# Altium schematic sheet main.SchDoc: Pulser Laser Board
size A4; Date: 04.08.2023; DocumentNumber: 1; SheetNumber: 1; SheetTotal: 2; FileInfo: main.SchDoc
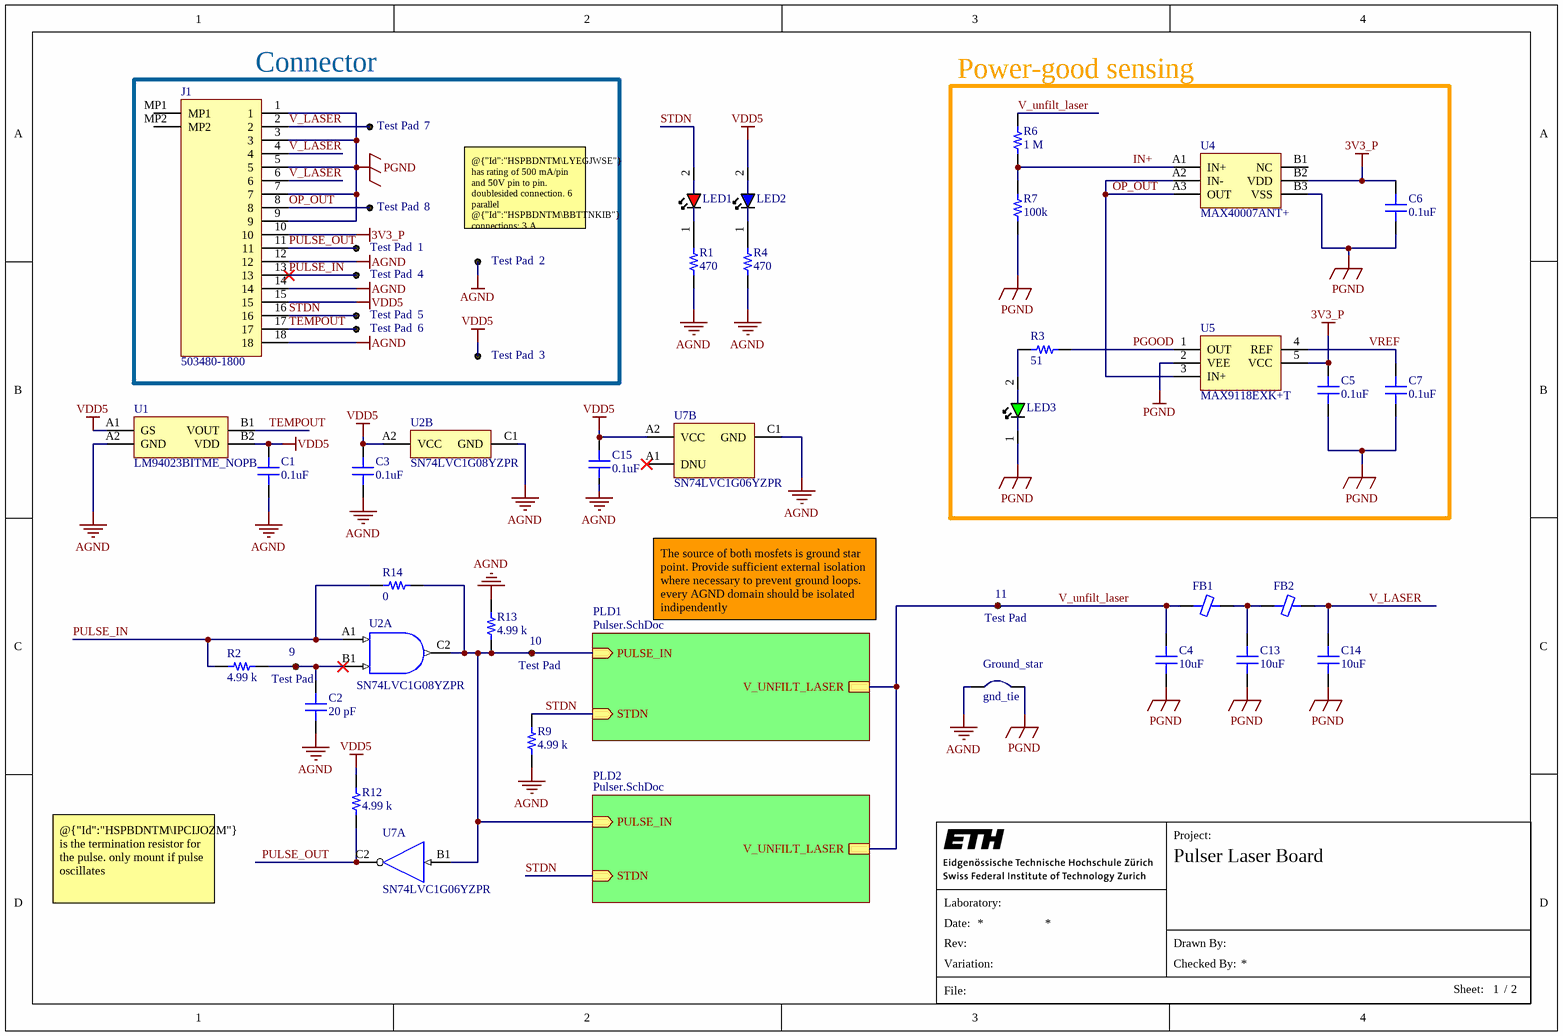
[diagram p0: main.SchDoc]

## Parts
1  Test Pad  [Pad-0.6mm]  (no BOM)
2  Test Pad  [Pad-0.6mm]  (no BOM)
3  Test Pad  [Pad-0.6mm]  (no BOM)
4  Test Pad  [Pad-0.6mm]  (no BOM)
5  Test Pad  [Pad-0.6mm]  (no BOM)
6  Test Pad  [Pad-0.6mm]  (no BOM)
7  Test Pad  [Pad-0.6mm]  (no BOM)
8  Test Pad  [Pad-0.6mm]  (no BOM)
9  Test Pad  [Pad-0.6mm]  (no BOM)
10  Test Pad  [Pad-0.6mm]  (no BOM)
11  Test Pad  [Pad-0.6mm]  (no BOM)
C1  0.1uF  [CAP 0201_0603]
C2  20 pF  [CAP 0402_1005]
C3  0.1uF  [CAP 0201_0603]
C4  10uF  [CAP 0603_1608]
C5  0.1uF  [CAP 0201_0603]
C6  0.1uF  [CAP 0201_0603]
C7  0.1uF  [CAP 0201_0603]
C13  10uF  [CAP 0603_1608]
C14  10uF  [CAP 0603_1608]
C15  0.1uF  [CAP 0201_0603]
FB1  (no value)  [FER 0603_1608]
FB2  (no value)  [FER 0603_1608]
Ground_star  gnd_tie  [GND_TIE]  (net tie, no BOM)
J1  503480-1800  [5034801800]
LED1  APG0603SEC-E-TT  [APG0603SECETT]  (value not drawn)
LED2  APG0603VBC-A1-5MAV  [APG0603SECETT]  (value not drawn)
LED3  APG0603ZGC-5MAV  [APG0603SECETT]  (value not drawn)
R1  470  [RES 0201_0603]
R2  4.99 k  [RES 0402_1005]
R3  51  [RES 0201_0603]
R4  470  [RES 0201_0603]
R6  1 M  [RES 0201_0603]
R7  100k  [RES 0201_0603]
R9  4.99 k  [RES 0201_0603]
R12  4.99 k  [RES 0402_1005]
R13  4.99 k  [RES 0201_0603]
R14  0  [RES 0201_0603]
U1  LM94023BITME_NOPB  [BGA4C40P2X2_81X81X68]
U2  SN74LVC1G08YZPR  [YZP0005ADAD]  (parts A,B of 2)
U4  MAX40007ANT+  [BGA6C40P3X2_124X84X69]
U5  MAX9118EXK+T  [SOT65P210X110-5N]
U7  SN74LVC1G06YZPR  [YZP0005ADAD]  (parts A,B of 2)

## Blocks framed on the sheet
Connector: 1-8 J1
Power-good sensing: C5-C7 LED3 R3 R6 R7 U4 U5

## Sub-sheets
PLD1 = Pulser.SchDoc: PULSE_IN (in), V_UNFILT_LASER, STDN (in)
PLD2 = Pulser.SchDoc: PULSE_IN (in), V_UNFILT_LASER, STDN (in)

## Nets
3V3_P: C5.2 C6.2 J1.10 U4.B2(VDD) U5.5(VCC)
AGND: 2.1 C1.1 C2.1 C3.1 C15.1 Ground_star.1 J1.12 J1.14 J1.18 R1.1 R4.1 R9.1 R13.1 U1.A2(GND) U2.C1(GND) U7.C1(GND)
PGND: C4.1 C5.1 C6.1 C7.1 C13.1 C14.1 Ground_star.2 J1.1 J1.3 J1.5 J1.7 J1.9 LED3.1(K) R7.1 U4.B3(VSS) U5.2(VEE)
VDD5: 3.1 C1.2 C3.2 C15.2 J1.15 LED2.2(A) R12.2 U1.A1(GS) U1.B2(VDD) U2.A2(VCC) U7.A2(VCC)
IN+: R6.1 R7.2 U4.A1(IN+)
OP_OUT: 8.1 J1.8 U4.A2(IN-) U4.A3(OUT) U5.3(IN+)
PGOOD: R3.2 U5.1(OUT)
PULSE_IN: 4.1 J1.13 R2.1 R14.1 U2.A1(A)
PULSE_OUT: 1.1 J1.11 R12.1 U7.C2(Y)
STDN: 5.1 J1.16 LED1.2(A) R9.2 ; sheet PLD1/STDN, sheet PLD2/STDN
TEMPOUT: 6.1 J1.17 U1.B1(VOUT)
V_LASER: 7.1 C14.2 FB2.2 J1.2 J1.4 J1.6
V_unfilt_laser: 11.1 C4.2 FB1.1 R6.2 ; sheet PLD1/V_UNFILT_LASER, sheet PLD2/V_UNFILT_LASER
VREF: C7.2 U5.4(REF)
Net9_1: 9.1 C2.2 R2.2 U2.B1(B)
Net10_1: 10.1 R13.2 R14.2 U2.C2(Y) U7.B1(A) ; sheet PLD1/PULSE_IN, sheet PLD2/PULSE_IN
NetC13_2: C13.2 FB1.2 FB2.1
NetLED1_1: LED1.1(K) R1.2
NetLED2_1: LED2.1(K) R4.2
NetLED3_2: LED3.2(A) R3.1

Not connected (* = marked no-connect by the designer): J1 MP1 MP2; U4 B1(NC); U7 A1(DNU)*

## Notes on the sheet
- (near 2) @{"Id":"HSPBDNTM\LYEGJWSE"}  has rating of 500 mA/pin and 50V pin to pin. doublesided connection. 6 parallel @{"Id":"HSPBDNTM\BBTTNKIB"} connections: 3 A
- The source of both mosfets is ground star point. Provide sufficient external isolation where necessary to prevent ground loops. every AGND domain should be isolated indipendently
- @{"Id":"HSPBDNTM\IPCIJOZM"} is the termination resistor for the pulse. only mount if pulse oscillates
- Project:
- Laboratory:
- Date:
- File:
- Rev:
- Variation:
- Drawn By:
- Checked By:
- Sheet:
- /

## Library data of the parts
1-11 = Test Pad: 0.6mm SMT Test Pad; Mounting Technology: SMT
C1 C3 C5-C7 C15 = GRM033R6YA104ME14D: CAP CER 0.1UF 35V X5R 0201; manufacturer: Murata Electronics; Capacitance: 0.1 µF; Tolerance: ±20%; Part Number: GRM033R6YA104ME14D; Applications: General Purpose; componentlink1description: Datasheet; componentlink1url: https://search.murata.co.jp/Ceramy/image/img/A01X/G101/ENG/GRM033R6YA104ME14-01.pdf; componentlink2description: DigiKey Link; componentlink2url: https://www.digikey.com/en/products/detail/murata-electronics/GRM033R6YA104ME14D/5027516; Device Package: 0201 (0603 Metric); lastupdated: 15/07/2023 19:00:56; Lifecycle Status: Active; Minimum Order: 1; Mounting Type: Surface Mount; Operating Temperature: -55°C ~ 85°C; Package / Case: 0201 (0603 Metric); packaging: CutTape; partid: 17; Part Status: Active; price: 0.01; series: GRM; Size / Dimension: 0.024" L x 0.012" W (0.60mm x 0.30mm); Supplier 1: Digi-Key; Supplier Part Number 1: 490-10431-1-ND; Temperature Coefficient: X5R; Thickness (Max): 0.013" (0.33mm); Voltage - Rated: 35V; Value: 0.1uF; Supplier 2: Mouser; Supplier Part Number 2: 81-GRM33R6YA104ME14D
C2 = GCM1555C1H200FA16D: CAP CER 20PF 50V C0G/NP0 0402; manufacturer: Murata Electronics; Temperature Coefficient: C0G, NP0; Tolerance: ±1%; Part Number: GCM1555C1H200FA16D; Applications: Automotive; Capacitance: 20 pF; componentlink1description: Datasheet; componentlink1url: https://search.murata.co.jp/Ceramy/image/img/A01X/G101/ENG/GCM1555C1H200FA16-01.pdf; componentlink2description: DigiKey Link; componentlink2url: https://www.digikey.com/en/products/detail/murata-electronics/GCM1555C1H200FA16D/13401847; Device Package: 0402 (1005 Metric); lastupdated: 15/07/2023 19:03:20; Lifecycle Status: Active; Minimum Order: 1; Mounting Type: Surface Mount, MLCC; Operating Temperature: -55°C ~ 125°C; Package / Case: 0402 (1005 Metric); packaging: TapeAndReel; partid: 45712; Part Status: Active; price: 0.01; Ratings: AEC-Q200; series: GCM; Size / Dimension: 0.039" L x 0.020" W (1.00mm x 0.50mm); Supplier 1: Digi-Key; Supplier Part Number 1: 490-GCM1555C1H200FA16DCT-ND; Thickness (Max): 0.022" (0.55mm); Voltage - Rated: 50V; Value: 20 pF; Supplier 2: Mouser; Supplier Part Number 2: 81-GCM1555C1H200FA6D
C4 C13 C14 = ZRB18AR61E106ME01L: CAP CER 10UF 25V X5R 0603; Manufacturer: Murata; Dielectric Material: Ceramic; Multilayer: Yes; Tolerance  (fill in as +-): 20%; Supplier 1: Mouser; Manufacturer Part Number: ZRB18AR61E106ME01L; RoHS: Yes; Category: Ceramic Capacitors; Stock 1: 348476; Pricing 1: 1=0.36, 10=0.18, 50=0.18, 100=0.128, 1000=0.122, 10000=0.097 (USD); Mounting Technology: Surface Mount; Pins: 2; Package Shape: Rectangular; Case/Package: 0603; Min Operating Temperature: -55°C; Max Operating Temperature: 85°C; Capacitor Type: Ceramic; Packaging: Tape and Reel; Tolerance (fill in as +-): 20%; Rated DC Voltage (URdc): 25V; Temperature Characteristics Code: X5R; Termination: Wraparound; Reach SVHC Compliant: Yes; RoHS Compliant: Yes; ComponentLink1URL: https://datasheet.ciiva.com:443/pdfs/VipMasterIC/IC/MURE/MURE-S-A0004380799/MURE-S-A0004414239-1.pdf?src-supplier=IHS+Markit; ComponentLink1Description: https://datasheet.ciiva.com:443/pdfs/VipMasterIC/IC/MURE/MURE-S-A0004380799/MURE-S-A0004414239-1.pdf?src-supplier=IHS+Markit; ComponentLink2URL: http://www.farnell.com/datasheets/2243360.pdf?src-supplier=Farnell; ComponentLink2Description: http://www.farnell.com/datasheets/2243360.pdf?src-supplier=Farnell; ComponentLink3URL: http://www.farnell.com/datasheets/2243360.pdf?src-supplier=Newark; ComponentLink3Description: http://www.farnell.com/datasheets/2243360.pdf?src-supplier=Newark; ComponentLink4URL: https://datasheet.octopart.com/ZRB18AR61E106ME01L-Murata-datasheet-67356777.pdf?src-supplier=Element14; ComponentLink4Description: https://datasheet.octopart.com/ZRB18AR61E106ME01L-Murata-datasheet-67356777.pdf?src-supplier=Element14; ComponentLink5URL: https://search.murata.co.jp/Ceramy/image/img/A01X/G101/ENG/ZRB18AR61E106ME01-01.pdf?src-supplier=Digi-Key; ComponentLink5Description: https://search.murata.co.jp/Ceramy/image/img/A01X/G101/ENG/ZRB18AR61E106ME01-01.pdf?src-supplier=Digi-Key; ComponentLink6URL: http://www.farnell.com/datasheets/1885591.pdf?src-supplier=Newark; ComponentLink6Description: http://www.farnell.com/datasheets/1885591.pdf?src-supplier=Newark; ComponentLink7URL: http://www.farnell.com/datasheets/2243360.pdf?src-supplier=Element14; ComponentLink7Description: http://www.farnell.com/datasheets/2243360.pdf?src-supplier=Element14; ComponentLink8URL: https://datasheet.octopart.com/ZRB18AR61E106ME01L-Murata-datasheet-166166243.pdf?src-supplier=TME; ComponentLink8Description: https://datasheet.octopart.com/ZRB18AR61E106ME01L-Murata-datasheet-166166243.pdf?src-supplier=TME; Supplier Part Number 1: 81-ZRB18AR61E106ME1L; Value: 10uF
FB1 FB2 = BLM18SP101SN1: FERRITE BEAD 100 OHM 0603 1LN; Manufacturer: Murata; Manufacturer Part Number: BLM18SP101SN1D; RoHS: Yes; Category: Ferrite Beads and Chips; Pricing 1: 1=0.21, 10=0.108, 50=0.108, 100=0.074, 1000=0.055, 10000=0.048 (USD); Stock 1: 17354; Supplier 1: Mouser; Supplier Part Number 1: 81-BLM18SP101SN1D
J1 = 503480-1800: Conn FPC  18 POS 0.5mm; Manufacturer: Molex; Supplier 1: Mouser; Manufacturer Part Number: 5034801800; RoHS: Yes; Category: FFC / FPC; Stock 1: 17529; Pricing 1: 1=1.48, 10=1.23, 50=1.23, 100=1.06, 1000=0.885, 10000=0.766 (USD); ComponentLink1URL: https://datasheet.ciiva.com/671/5034800400-sd-671136.pdf?src-supplier=Digi-Key; ComponentLink1Description: https://datasheet.ciiva.com/671/5034800400-sd-671136.pdf?src-supplier=Digi-Key; ComponentLink2URL: https://datasheet.ciiva.com/10366/5034801800-ffc-fpc-connectors-10366583.pdf?src-supplier=Avnet; ComponentLink2Description: https://datasheet.ciiva.com/10366/5034801800-ffc-fpc-connectors-10366583.pdf?src-supplier=Avnet; ComponentLink3URL: https://datasheet.ciiva.com/5137/5034801800-ffc-fpc-connectors-179548-5137672.pdf?src-supplier=Mouser; ComponentLink3Description: https://datasheet.ciiva.com/5137/5034801800-ffc-fpc-connectors-179548-5137672.pdf?src-supplier=Mouser; Supplier Part Number 1: 538-503480-1800
LED1 = APG0603SEC-E-TT: Diode LED RED 10 mA @ 1.93 V lv=40; Manufacturer: Kingbright; Optoelectronic Device Type: SINGLE COLOR LED; Supplier 1: Mouser; Manufacturer Part Number: APG0603SEC-E-TT; RoHS: Yes; Category: LEDs; Stock 1: 6830; Pricing 1: 1=0.49, 10=0.299, 50=0.299, 100=0.172, 1000=0.123, 10000=0.106 (USD); Reach SVHC Compliant: Yes; RoHS Compliant: Yes; ComponentLink1URL: https://datasheet.ciiva.com:443/pdfs/VipMasterIC/IC/KBEC/KBEC-S-A0008424280/KBEC-S-A0008424280-1.pdf?src-supplier=IHS+Markit; ComponentLink1Description: https://datasheet.ciiva.com:443/pdfs/VipMasterIC/IC/KBEC/KBEC-S-A0008424280/KBEC-S-A0008424280-1.pdf?src-supplier=IHS+Markit; ComponentLink2URL: http://www.kingbrightusa.com/images/catalog/SPEC/APG0603SEC-E-TT.pdf?src-supplier=Digi-Key; ComponentLink2Description: http://www.kingbrightusa.com/images/catalog/SPEC/APG0603SEC-E-TT.pdf?src-supplier=Digi-Key; Supplier Part Number 1: 604-APG0603SECETT
LED2 = APG0603VBC-A1-5MAV: Diode LED BLUE 10 mA @ 2.9 V lv=60; Manufacturer: Kingbright; Supplier 1: Mouser; Manufacturer Part Number: APG0603VBC-A1-5MAV; RoHS: Yes; Category: LEDs; Stock 1: 23353; Pricing 1: 1=0.64, 10=0.396, 50=0.396, 100=0.228, 1000=0.171, 10000=0.146 (USD); Supplier Part Number 1: 604-APG0603VBCA15MAV
LED3 = APG0603ZGC-5MAV: Diode LED GREEN 5 mA @ 2.85 V lv=80(?); Manufacturer: Kingbright; Supplier 1: Mouser; Manufacturer Part Number: APG0603ZGC-5MAV; RoHS: Yes; Category: LEDs; Stock 1: 11940; Pricing 1: 1=0.54, 10=0.335, 50=0.335, 100=0.193, 1000=0.139, 10000=0.118 (USD); Supplier Part Number 1: 604-APG0603ZGC-5MAV
R1 R4 = ERJ-1GNF4991C_1: RES SMD 470 OHM 1% 1/20W 0201; Manufacturer: Panasonic; Manufacturer Part Number: ERJ-1GNF4700C; Power: 50mW; Rated Temperature: 70°C; Temperature Coefficient: 200ppm/°C; Working Voltage: 25V; Package Height: 0.23mm; Package Length: 0.6mm; Package Width: 0.3mm; Reference Standard: AEC-Q200; Supplier: Mouser; Supplier Part Number: 667-ERJ-1GNF4700C; RoHS: Yes; Category: Chip SMD Resistors; Stock: 294822; Pricing: 1=0.1, 10=0.03, 50=0.03, 100=0.014, 1000=0.01, 10000=0.007 (USD); Mounting Technology: Surface Mount; Pins: 2; Package Shape: Rectangular; Case/Package: 0201; Terminal Finish: Nickel; Min Operating Temperature: -55°C; Max Operating Temperature: 125°C; Tolerance: 1%; JESD-609 Code: e3; Resistor Type: FIXED RESISTOR; Construction: Rectangular; Package Style: SMTMeter; Packaging: Tape and Reel; Value: 470; Technology: METAL GLAZE/THICK FILM; Termination: Wraparound; Reach SVHC Compliant: Yes; RoHS Compliant: Yes; ComponentLink1URL: https://datasheet.ciiva.com:443/pdfs/VipMasterIC/IC/PANA/PANA-S-A0009889626/PANA-S-A0009889626-1.pdf?src-supplier=IHS+Markit; ComponentLink1Description: https://datasheet.ciiva.com:443/pdfs/VipMasterIC/IC/PANA/PANA-S-A0009889626/PANA-S-A0009889626-1.pdf?src-supplier=IHS+Markit; ComponentLink2URL: https://datasheet.ciiva.com/24027/aoa0000ce2-24027045.pdf?src-supplier=Mouser; ComponentLink2Description: https://datasheet.ciiva.com/24027/aoa0000ce2-24027045.pdf?src-supplier=Mouser; ComponentLink3URL: https://datasheet.ciiva.com/43467/1678782-43467046.pdf?src-supplier=Farnell; ComponentLink3Description: https://datasheet.ciiva.com/43467/1678782-43467046.pdf?src-supplier=Farnell; ComponentLink4URL: https://datasheet.ciiva.com/46375/1678782-46375269.pdf?src-supplier=Element14; ComponentLink4Description: https://datasheet.ciiva.com/46375/1678782-46375269.pdf?src-supplier=Element14; ComponentLink5URL: https://datasheet.ciiva.com/7830/1678782-7830713.pdf?src-supplier=Element14; ComponentLink5Description: https://datasheet.ciiva.com/7830/1678782-7830713.pdf?src-supplier=Element14; Supplier 1: Mouser; Supplier Part Number 1: 667-ERJ-1GNF4700C
R2 R12 = ERA-2AEB4991X: RES SMD 4.99KOHM 0.1% 1/16W 0402; Manufacturer: Panasonic Electronic Components; Power (Watts): 0.063W, 1/16W; Resistance: 4.99 kOhms; Temperature Coefficient: ±25ppm/°C; Part Number: ERA-2AEB4991X; ComponentLink1Description: Datasheet; ComponentLink1URL: https://industrial.panasonic.com/cdbs/www-data/pdf/RDM0000/AOA0000C307.pdf; ComponentLink2Description: DigiKey Link; ComponentLink2URL: https://www.digikey.com/en/products/detail/panasonic-electronic-components/ERA-2AEB4991X/2026116; Composition: Thin Film; Device Package: 0402 (1005 Metric); Features: Automotive AEC-Q200; Height - Seated (Max): 0.016" (0.40mm); LastUpdated: 13/07/2023 19:22:52; Lifecycle Status: Active; Minimum Order: 1; Number of Terminations: 2; Operating Temperature: -55°C ~ 155°C; Package / Case: 0402 (1005 Metric); Packaging: TapeAndReel; PartId: 6112; Part Status: Active; Price: 0.04; Ratings: AEC-Q200; Series: ERA-2A; Size / Dimension: 0.039" L x 0.020" W (1.00mm x 0.50mm); Supplier 1: Digi-Key; Supplier Part Number 1: 10-ERA-2AEB4991XCT-ND; Supplier Device Package: 0402; Tolerance: ±0.1%; Value: 4.99 k; Supplier 2: Mouser; Supplier Part Number 2: 667-ERA-2AEB4991X
R3 = ERJ-1GNF51R0C: RES SMD 51 OHM 1% 1/20W 0201; Manufacturer: Panasonic; Manufacturer Part Number: ERJ1GNF51R0C; Power: 50mW; Rated Temperature: 70°C; Temperature Coefficient: 200ppm/°C; Working Voltage: 25V; Package Height: 0.23mm; Package Length: 0.6mm; Package Width: 0.3mm; Reference Standard: AEC-Q200; Supplier: Mouser; Supplier Part Number: 667-ERJ-1GNF51R0C; RoHS: Yes; Category: Chip SMD Resistors; Stock: 39473; Pricing: 1=0.1, 10=0.033, 50=0.033, 100=0.015, 1000=0.011, 10000=0.007 (USD); Mounting Technology: Surface Mount; Pins: 2; Package Shape: Rectangular; Case/Package: 0201; Terminal Finish: Nickel; Min Operating Temperature: -55°C; Max Operating Temperature: 125°C; Tolerance: 1%; JESD-609 Code: e3; Resistor Type: FIXED RESISTOR; Construction: Rectangular; Package Style: SMTMeter; Packaging: Tape and Reel; Value: 51; Technology: METAL GLAZE/THICK FILM; Termination: Wraparound; Reach SVHC Compliant: Yes; RoHS Compliant: Yes; ComponentLink1URL: https://datasheet.ciiva.com:443/pdfs/VipMasterIC/IC/PANA/PANA-S-A0009889626/PANA-S-A0009889626-1.pdf?src-supplier=IHS+Markit; ComponentLink1Description: https://datasheet.ciiva.com:443/pdfs/VipMasterIC/IC/PANA/PANA-S-A0009889626/PANA-S-A0009889626-1.pdf?src-supplier=IHS+Markit; ComponentLink2URL: https://datasheet.ciiva.com/43467/1678782-43467023.pdf?src-supplier=Farnell; ComponentLink2Description: https://datasheet.ciiva.com/43467/1678782-43467023.pdf?src-supplier=Farnell; ComponentLink3URL: https://datasheet.ciiva.com/24130/aoa0000ce2-24130655.pdf?src-supplier=Mouser; ComponentLink3Description: https://datasheet.ciiva.com/24130/aoa0000ce2-24130655.pdf?src-supplier=Mouser; ComponentLink4URL: https://datasheet.ciiva.com/46375/1678782-46375932.pdf?src-supplier=Element14; ComponentLink4Description: https://datasheet.ciiva.com/46375/1678782-46375932.pdf?src-supplier=Element14; ComponentLink5URL: https://datasheet.ciiva.com/7891/aoa0000ce2-7891288.pdf?src-supplier=Element14; ComponentLink5Description: https://datasheet.ciiva.com/7891/aoa0000ce2-7891288.pdf?src-supplier=Element14; Supplier 1: Mouser; Supplier Part Number 1: 667-ERJ-1GNF51R0C
R6 = ERJ-U01F1004C: RES SMD 1MOHM 1% 1/20W 0201; Manufacturer: Panasonic; Supplier: Mouser; Supplier Part Number: 667-ERJ-U01F1004C; Manufacturer Part Number: ERJ-U01F1004C; RoHS: Yes; Category: Chip SMD Resistors; Stock: 28729; Pricing: 1=0.35, 10=0.157, 50=0.157, 100=0.071, 1000=0.049, 10000=0.038 (USD); ComponentLink1URL: https://datasheet.ciiva.com/24200/ras-erj-u-267552-24200389.pdf?src-supplier=Mouser; ComponentLink1Description: https://datasheet.ciiva.com/24200/ras-erj-u-267552-24200389.pdf?src-supplier=Mouser; Supplier 1: Mouser; Supplier Part Number 1: 667-ERJ-U01F1004C
R7 = ERJ-1RHD1003C: RES SMD 100 kOHM 0.5% 1/20W 0201; Manufacturer: Panasonic; Additional Feature: PRECISION; Power: 50mW; Rated Temperature: 70°C; Temperature Coefficient: 50ppm/°C; Working Voltage: 15V; Package Height: 0.23mm; Package Length: 0.6mm; Package Width: 0.3mm; Supplier 1: Mouser; Manufacturer Part Number: ERJ-1RHD1003C; RoHS: Yes; Category: Chip SMD Resistors; Stock 1: 3926; Pricing 1: 1=0.14, 10=0.049, 50=0.049, 100=0.03, 1000=0.021, 10000=0.016 (USD); Mounting Technology: Surface Mount; Pins: 2; Package Shape: Rectangular; Case/Package: 0201; Terminal Finish: Nickel; Min Operating Temperature: -55°C; Max Operating Temperature: 125°C; Tolerance: 0.5%; JESD-609 Code: e3; Resistor Type: FIXED RESISTOR; Construction: Rectangular; Package Style: SMTMeter; Packaging: Tape and Reel; Value: 100k; Technology: METAL GLAZE/THICK FILM; Termination: Wraparound; Reach SVHC Compliant: Yes; RoHS Compliant: Yes; ComponentLink1URL: https://datasheet.ciiva.com:443/pdfs/VipMasterIC/IC/PANA/PANA-S-A0009889626/PANA-S-A0009889626-1.pdf?src-supplier=IHS+Markit; ComponentLink1Description: https://datasheet.ciiva.com:443/pdfs/VipMasterIC/IC/PANA/PANA-S-A0009889626/PANA-S-A0009889626-1.pdf?src-supplier=IHS+Markit; ComponentLink2URL: http://www.mouser.com/ds/2/315/AOA0000C283-1093288.pdf?src-supplier=Mouser; ComponentLink2Description: http://www.mouser.com/ds/2/315/AOA0000C283-1093288.pdf?src-supplier=Mouser; ComponentLink3URL: https://industrial.panasonic.com/cdbs/www-data/pdf/RDA0000/AOA0000C304.pdf?src-supplier=Digi-Key; ComponentLink3Description: https://industrial.panasonic.com/cdbs/www-data/pdf/RDA0000/AOA0000C304.pdf?src-supplier=Digi-Key; ComponentLink4URL: https://industrial.panasonic.com/cdbs/www-data/pdf/RDM0000/DMM0000COL11.pdf?src-supplier=Digi-Key; ComponentLink4Description: https://industrial.panasonic.com/cdbs/www-data/pdf/RDM0000/DMM0000COL11.pdf?src-supplier=Digi-Key; ComponentLink5URL: http://www.onlinecomponents.com/datasheet/erj-1rhd1003c.aspx?p=44466300&src-supplier=Onlinecomponents.com; ComponentLink5Description: http://www.onlinecomponents.com/datasheet/erj-1rhd1003c.aspx?p=44466300&src-supplier=Onlinecomponents.com; ComponentLink6URL: https://datasheet.octopart.com/ERJ-1RHD1003C-Panasonic-datasheet-48891056.pdf?src-supplier=Future+Electronics; ComponentLink6Description: https://datasheet.octopart.com/ERJ-1RHD1003C-Panasonic-datasheet-48891056.pdf?src-supplier=Future+Electronics; ComponentLink7URL: https://datasheet.octopart.com/ERJ-1RHD1003C-Panasonic-datasheet-13266541.pdf?src-supplier=Electro+Sonic; ComponentLink7Description: https://datasheet.octopart.com/ERJ-1RHD1003C-Panasonic-datasheet-13266541.pdf?src-supplier=Electro+Sonic; ComponentLink8URL: https://datasheet.octopart.com/ERJ-1RHD1003C-Panasonic-datasheet-154766169.pdf?src-supplier=Master+Electronics; ComponentLink8Description: https://datasheet.octopart.com/ERJ-1RHD1003C-Panasonic-datasheet-154766169.pdf?src-supplier=Master+Electronics; Supplier Part Number 1: 667-ERJ-1RHD1003C
R9 R13 = ERJ-1GNF4991C: RES SMD 4.99 kOHM 1% 1/20W 0201; Manufacturer: Panasonic; Supplier: Mouser; Supplier Part Number: 667-ERJ-1GNF4991C; Manufacturer Part Number: ERJ-1GNF4991C; RoHS: Yes; Category: Chip SMD Resistors; Stock: 73903; Pricing: 1=0.1, 10=0.033, 50=0.033, 100=0.015, 1000=0.011, 10000=0.007 (USD); ComponentLink1URL: https://datasheet.ciiva.com/24210/aoa0000ce2-24210761.pdf?src-supplier=Mouser; ComponentLink1Description: https://datasheet.ciiva.com/24210/aoa0000ce2-24210761.pdf?src-supplier=Mouser; Supplier 1: Mouser; Supplier Part Number 1: 667-ERJ-1GNF4991C; Value: 4.99 k
R14 = ERJ-1GN0R00C: RES SMD 0OHM 0.1% 1/20W 0201; Manufacturer: Panasonic; Power: 50mW; Rated Temperature: 70°C; Package Height: 0.23mm; Package Length: 0.6mm; Package Width: 0.3mm; Reference Standard: AEC-Q200; Supplier: Mouser; Supplier Part Number: 667-ERJ-1GN0R00C; Manufacturer Part Number: ERJ-1GN0R00C; RoHS: Yes; Category: Chip SMD Resistors; Stock: 4285208; Pricing: 1=0.1, 10=0.018, 50=0.018, 100=0.008, 1000=0.006, 10000=0.004 (USD); Mounting Technology: Surface Mount; Pins: 2; Package Shape: Rectangular; Case/Package: 0201; Terminal Finish: Nickel; Min Operating Temperature: -55°C; Max Operating Temperature: 125°C; JESD-609 Code: e3; Resistor Type: FIXED RESISTOR; Construction: Rectangular; Package Style: SMTMeter; Packaging: Tape and Reel; Value: 0; Technology: METAL GLAZE/THICK FILM; Termination: Wraparound; Reach SVHC Compliant: Yes; RoHS Compliant: Yes; ComponentLink1URL: https://datasheet.ciiva.com:443/pdfs/VipMasterIC/IC/PANA/PANA-S-A0009459603/PANA-S-A0009459603-1.pdf?src-supplier=IHS+Markit; ComponentLink1Description: https://datasheet.ciiva.com:443/pdfs/VipMasterIC/IC/PANA/PANA-S-A0009459603/PANA-S-A0009459603-1.pdf?src-supplier=IHS+Markit; Supplier 1: Mouser; Supplier Part Number 1: 667-ERJ-1GN0R00C
U1 = LM94023BITME_NOPB: IC temperature sensor; Manufacturer_Name: Texas Instruments; Manufacturer_Part_Number: LM94023BITME/NOPB; Datasheet Link: http://www.ti.com/lit/gpn/lm94023; Height: 0.675mm; Mouser Part Number: 926-94023BITME/NOPB; Mouser Price/Stock: https://www.mouser.co.uk/ProductDetail/Texas-Instruments/LM94023BITME-NOPB?qs=QbsRYf82W3GaNge%252BVoa5rg%3D%3D; Arrow Part Number: LM94023BITME/NOPB; Arrow Price/Stock: https://www.arrow.com/en/products/lm94023bitmenopb/texas-instruments; Supplier 1: Mouser; Supplier Part Number 1: 926-94023bitME/NOPB
U2 = SN74LVC1G08YZPR: IC Single 2-Input Positive-AND Gate, YZP0005ADAD, LARGE T&R; Manufacturer: Texas Instruments; Voltage(Nom)(V): 1.8,2.5,3.3,5; VCC(Min)(V): 1.65; Bits(#): 1; VCC(Max)(V): 5.5; ICC @ Nom Voltage(Max)(mA): 0.01; Input Type: CMOS/TTL; Output Type: CMOS; 3-State Output: No; Output Drive (IOL/IOH)(Max)(mA): 32/-32; Logic: True; Gate Type: AND; F @ Nom Voltage(Max)(Mhz): 150; tpd @ Nom Voltage(Max)(ns): 4.5,6,4,5; Technology Family: LVC; Rating: Catalog; Sub-Family: AND Gate; Operating Temperature Range(C): -40 to 125,-40 to 85; PackageReference: YZP0005ADAD; Schmitt Trigger: No; Generic Part Number: SN74LVC1G08; DatasheetVersion: SCES217Y; Manufacturer Part Number: SN74LVC1G08YZPR; Supplier 1: Mouser; Supplier Part Number 1: 595-SN74LVC1G08YZPR
U4 = MAX40007ANT+: Operational Amplifier; Manufacturer: Maxim; Manufacturer Part Number: MAX40007ANT+T; Amplifier Type: OPERATIONAL AMPLIFIER; Category: Amplifiers - Op Amps, Buffer, Instrumentation; ComponentLink1Description: https://datasheet.ciiva.com:443/pdfs/VipMasterIC/IC/MAXM/MAXM-S-A0004197655/MAXM-S-A0004197655-1.pdf?src-supplier=IHS+Markit; ComponentLink1URL: https://datasheet.ciiva.com:443/pdfs/VipMasterIC/IC/MAXM/MAXM-S-A0004197655/MAXM-S-A0004197655-1.pdf?src-supplier=IHS+Markit; ComponentLink2Description: https://datasheets.maximintegrated.com/en/ds/MAX40007.pdf?src-supplier=Digi-Key; ComponentLink2URL: https://datasheets.maximintegrated.com/en/ds/MAX40007.pdf?src-supplier=Digi-Key; Pricing 1: 1=2.12, 10=1.86, 50=1.86, 100=1.53, 1000=1.04, 10000=0.932 (USD); Reach SVHC Compliant: Yes; RoHS: Yes; RoHS Compliant: Yes; Stock 1: 4078; Supplier 1: Mouser; Supplier Part Number 1: 700-MAX40007ANT+T
U5 = MAX9118EXK+T: IC comparator; Manufacturer: Maxim; Average Bias Current-Max (IIB): 2nA; Bias Current-Max (IIB) @25C: 1nA; Channels: 1; Input Offset Voltage-Max: 10mV; Max Supply Current: 1.3uA; Nominal Supply Voltage: 5V; Output Type: OPEN-DRAIN; Package Body Material: Plastic; Package Equivalence Code: TSSOP5/6,.08; Power Supplies: 2.5V; Qualification Status: Not Qualified; Supply Voltage Limit-Max: 6V; Amplifier Type: COMPARATOR; Case/Package: TSSOP; Category: Comparators; ComponentLink1Description: https://datasheet.ciiva.com:443/pdfs/VipMasterIC/IC/MAXM/MAXMS06218/MAXMS06218-1.pdf?src-supplier=IHS+Markit; ComponentLink1URL: https://datasheet.ciiva.com:443/pdfs/VipMasterIC/IC/MAXM/MAXMS06218/MAXMS06218-1.pdf?src-supplier=IHS+Markit; ComponentLink2Description: https://datasheet.ciiva.com/1828/max9117-max9120-1828265.pdf?src-supplier=Digi-Key; ComponentLink2URL: https://datasheet.ciiva.com/1828/max9117-max9120-1828265.pdf?src-supplier=Digi-Key; ComponentLink3Description: https://datasheet.ciiva.com/1828/max9117-max9120-1828266.pdf?src-supplier=Digi-Key; ComponentLink3URL: https://datasheet.ciiva.com/1828/max9117-max9120-1828266.pdf?src-supplier=Digi-Key; ComponentLink4Description: https://datasheet.ciiva.com/1828/max9117-max9120-1828267.pdf?src-supplier=Digi-Key; ComponentLink4URL: https://datasheet.ciiva.com/1828/max9117-max9120-1828267.pdf?src-supplier=Digi-Key; ComponentLink5Description: https://datasheet.ciiva.com/2972/max9117-max9120-2972518.pdf?src-supplier=Avnet; ComponentLink5URL: https://datasheet.ciiva.com/2972/max9117-max9120-2972518.pdf?src-supplier=Avnet; ComponentLink6Description: https://datasheet.ciiva.com/2971/max9117-max9120-2971017.pdf?src-supplier=Avnet; ComponentLink6URL: https://datasheet.ciiva.com/2971/max9117-max9120-2971017.pdf?src-supplier=Avnet; ComponentLink7Description: https://datasheet.ciiva.com/12286/max9117-max9120-12286604.pdf?src-supplier=Mouser; ComponentLink7URL: https://datasheet.ciiva.com/12286/max9117-max9120-12286604.pdf?src-supplier=Mouser; Height - Seated (Max): 1.1mm; JESD-30 Code: R-PDSO-G5; JESD-609 Code: e3; Length: 2mm; Manufacturer Part Number: MAX9118EXK+T; Max Operating Temperature: 85°C; Min Operating Temperature: -40°C; Moisture Sensitivity Level: 1; Package Shape: Rectangular; Package Style: SMALL OUTLINE, THIN PROFILE, SHRINK PITCHMeter; Peak Reflow Temperature (Cel): 260°C; Pins: 5; Pricing 1: 1=2.47, 10=2.16, 50=2.16, 100=1.97, 1000=1.38, 10000=1.26 (USD); Reach SVHC Compliant: Yes; RoHS: Yes; RoHS Compliant: Yes; Stock 1: 3088; Supplier 1: Mouser; Supplier Part Number 1: 700-MAX9118EXKT; Surface Mount: Yes; Temperature Grade: INDUSTRIAL; Terminal Finish: Tin; Terminal Form: Gull Wing; Terminal Pitch: 0.65mm; Terminal Position: DUAL; Width: 1.25mm
U7 = SN74LVC1G06YZPR: IC Single Inverter Buffer/Driver With Open-Drain Output, YZP0005ADAD, LARGE T&R; Manufacturer: Texas Instruments; Voltage(Nom)(V): 1.8,2.5,3.3,5; ICC @ Nom Voltage(Max)(mA): 0.01; VCC(Min)(V): 1.65; tpd @ Nom Voltage(Max)(ns): 6.5,4,3; Input Type: CMOS/TTL; F @ Nom Voltage(Max)(Mhz): 150; Output Type: CMOS; Technology Family: LVC; Rating: Catalog; Schmitt Trigger: No; Sub-Family: Inverting Buffer/Driver; Output Drive (IOL/IOH)(Max)(mA): 32/-32; VCC(Max)(V): 5.5; Bits(#): 1; Logic: Inverting; PackageReference: YZP0005ADAD; 3-State Output: No; Generic Part Number: SN74LVC1G06; DatasheetVersion: SCES295W; Operating Temperature Range(C): -40 to 125,-40 to 85; Manufacturer Part Number: SN74LVC1G06YZPR; Supplier 1: Mouser; Supplier Part Number 1: 595-SN74LVC1G06YZPR